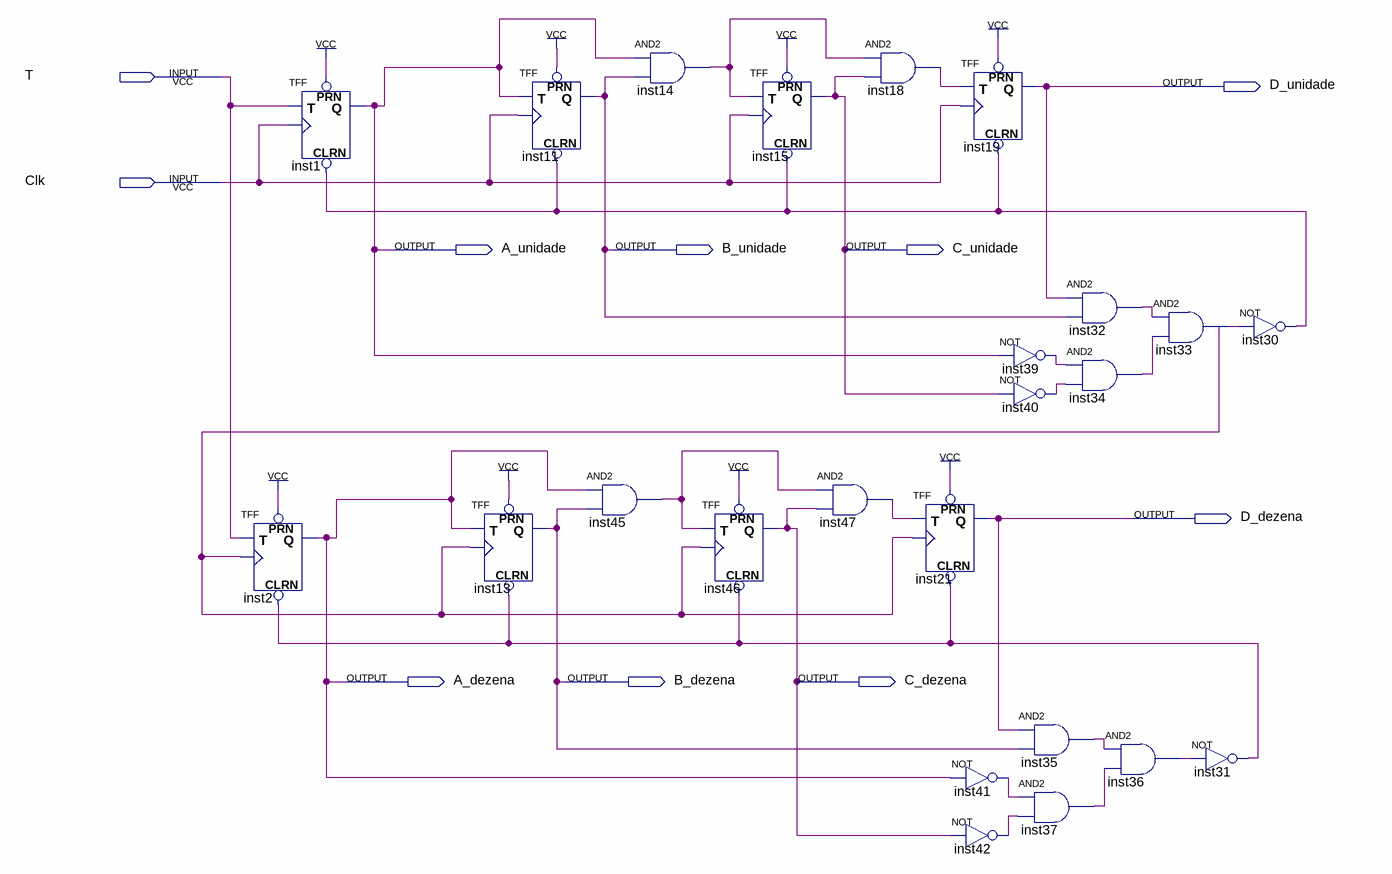
[diagram p0: schematic sheet]
// Quartus schematic Contador_2DIG.bdf as structural Verilog: 24 symbols, 10 pins
module Contador_2DIG (
  input  T,
  input  Clk,
  output D_unidade,
  output A_unidade,
  output B_unidade,
  output C_unidade,
  output D_dezena,
  output A_dezena,
  output B_dezena,
  output C_dezena
);

  wire inst14_out, inst18_out, inst30_out, inst31_out, inst32_out, inst33_out, inst34_out, inst35_out,
       inst36_out, inst37_out, inst39_out, inst40_out, inst41_out, inst42_out, inst45_out, inst47_out;

  TFF inst2 (.PRN(1'b1), .CLRN(inst31_out), .T(T), .CLK(inst33_out), .Q(A_dezena));
  TFF inst1 (.PRN(1'b1), .CLRN(inst30_out), .T(T), .CLK(Clk), .Q(A_unidade));
  TFF inst13 (.PRN(1'b1), .CLRN(inst31_out), .T(A_dezena), .CLK(inst33_out), .Q(B_dezena));
  TFF inst11 (.PRN(1'b1), .CLRN(inst30_out), .T(A_unidade), .CLK(Clk), .Q(B_unidade));
  and inst14 (inst14_out, A_unidade, B_unidade);
  and inst45 (inst45_out, A_dezena, B_dezena);
  TFF inst46 (.PRN(1'b1), .CLRN(inst31_out), .T(inst45_out), .CLK(inst33_out), .Q(C_dezena));
  TFF inst15 (.PRN(1'b1), .CLRN(inst30_out), .T(inst14_out), .CLK(Clk), .Q(C_unidade));
  and inst18 (inst18_out, inst14_out, C_unidade);
  and inst47 (inst47_out, inst45_out, C_dezena);
  TFF inst21 (.PRN(1'b1), .CLRN(inst31_out), .T(inst47_out), .CLK(inst33_out), .Q(D_dezena));
  not inst41 (inst41_out, A_dezena);
  not inst42 (inst42_out, C_dezena);
  TFF inst19 (.PRN(1'b1), .CLRN(inst30_out), .T(inst18_out), .CLK(Clk), .Q(D_unidade));
  not inst39 (inst39_out, A_unidade);
  not inst40 (inst40_out, C_unidade);
  and inst35 (inst35_out, D_dezena, B_dezena);
  and inst37 (inst37_out, inst41_out, inst42_out);
  and inst32 (inst32_out, D_unidade, B_unidade);
  and inst34 (inst34_out, inst39_out, inst40_out);
  and inst36 (inst36_out, inst35_out, inst37_out);
  and inst33 (inst33_out, inst32_out, inst34_out);
  not inst30 (inst30_out, inst33_out);
  not inst31 (inst31_out, inst36_out);
endmodule
